# EAGLE schematic main_box_pcb_v0 (EAGLE 9.7.0)
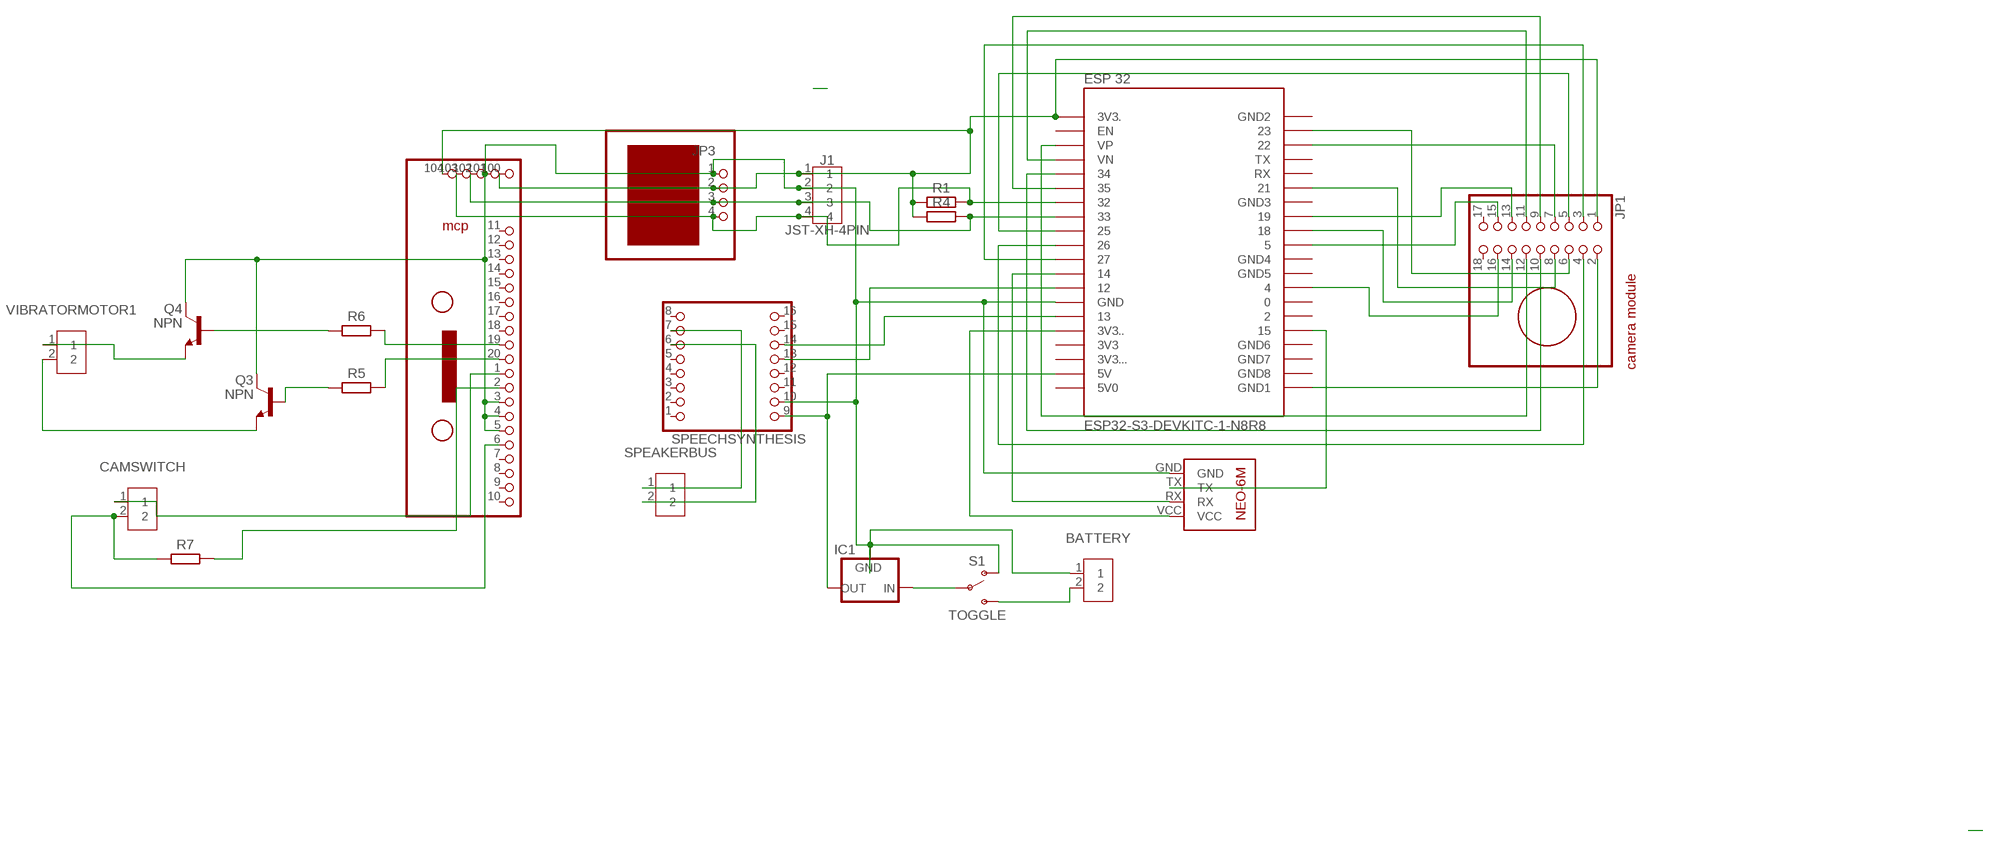
[diagram p0: schematic, sheet 1]

## Parts
BATTERY  JST-VH-2PIN  B2P-VH  [B2P-VH_396-2N]
CAMSWITCH  JST-VH-2PIN  B2P-VH  [B2P-VH_396-2N]
IC1  78MXXS  [78MXXS]
J1  JST-XH-4PIN  B4B-XH-A  [B4B-XH-A]
JP1  PINHD-2X9  [2X09]
JP3  PINHD-1X4  [1X04]
JP5  PINHD-1X10  [1X10]
Q3  NPN  NPN_TO92-EBC  [TO92]
Q4  NPN  NPN_TO92-EBC  [TO92]
R1  RESISTOR__AXIAL-11.7MM-PITCH  [RESAD1176W63L850D250B]
R4  RESISTOR__AXIAL-11.7MM-PITCH  [RESAD1176W63L850D250B]
R5  RESISTOR__AXIAL-7.2MM-PITCH  [RESAD724W46L381D178B]
R6  RESISTOR__AXIAL-7.2MM-PITCH  [RESAD724W46L381D178B]
R7  RESISTOR__AXIAL-7.2MM-PITCH  [RESAD724W46L381D178B]
S1  TOGGLE  [SWITCH-SPDT-PTH-8.5X3.7MM]
SPEAKERBUS  JST-VH-2PIN  B2P-VH  [B2P-VH_396-2N]
SPEECHSYNTHESIS  PINHD-1X8  [1X08]
U$1  ESP32-S3-DEVKITC-1-N8R8  [ESP32-S3-DEVKITC-1-N8R8]
U$2  NEO-6M  [NEO-6M]
VIBRATORMOTOR1  JST-VH-2PIN  B2P-VH  [B2P-VH_396-2N]

## Nets
N$1: IC1.OUT SPEECHSYNTHESIS.9(VCC) U$1.J1_20(5V)
N$3: JP1.2(GND) U$1.J3_21(GND1)
N$4: JP1.3(SIOC) U$1.J1_12
N$5: JP1.4(SIOD) U$1.J1_11
N$6: JP1.5(VSYNC) U$1.J1_10
N$7: JP1.6(HREF) U$1.J3_3
N$8: JP1.7(PCLK) U$1.J3_4
N$9: JP1.8(XCLK) U$1.J3_7
N$10: JP1.9(D9) U$1.J1_7
N$11: JP1.10(D8) U$1.J1_6
N$12: JP1.11(D7) U$1.J1_5(VN)
N$13: JP1.12(D6) U$1.J1_4(VP)
N$14: JP1.13(D5) U$1.J3_9
N$15: JP1.14(D4) U$1.J3_10
N$16: JP1.15(D2) U$1.J3_11
N$17: JP1.16(D1) U$1.J3_14
N$18: U$1.J1_17(3V3..) U$2.VCC
N$19: J1.4 JP3.4 JP5.103 R1.2 U$1.J1_8
N$20: J1.3 JP3.3 JP5.102 R4.2 U$1.J1_9
N$21: SPEAKERBUS.1 SPEECHSYNTHESIS.7(GND1)
N$22: JP5.20(PB0) R5.2
N$24: JP5.19(PB1) R6.2
N$25: IC1.IN S1.2(P)
N$26: U$1.J3_17 U$2.TX
N$27: U$1.J1_13 U$2.RX
N$28: BATTERY.2 S1.3(S)
N$29: SPEECHSYNTHESIS.13(DAC_L) U$1.J1_14
N$30: SPEECHSYNTHESIS.14(SPK_1) U$1.J1_16
N$31: BATTERY.1 IC1.GND J1.2 JP3.1 JP5.3(PA0) JP5.4(PA1) JP5.5(PA2) JP5.101 Q3.3(C) Q4.3(C) S1.1(O) SPEECHSYNTHESIS.10(RX) U$1.J1_15(GND) U$2.GND
N$32: SPEAKERBUS.2 SPEECHSYNTHESIS.6(IO_2)
N$36: J1.1 JP1.1(3.3) JP3.2 JP5.100 JP5.104 R1.1 R4.1 U$1.J1_2(3V3.)
N$42: Q4.2(B) R6.1
N$44: Q3.2(B) R5.1
N$45: Q3.1(E) VIBRATORMOTOR1.2
N$46: Q4.1(E) VIBRATORMOTOR1.1
N$47: CAMSWITCH.1 JP5.1(VCC)
N$48: JP5.2(GND) R7.2
N$50: CAMSWITCH.2 JP5.6(PA3) R7.1
Unconnected: JP1.17(RET) JP1.18(PWDN) JP5.7(PA4) JP5.8(PA5) JP5.9(PA6) JP5.10(PA7) JP5.11(VCC1) JP5.12 JP5.13(PB7) JP5.14(PB6) JP5.15(PB5) JP5.16(PB4) JP5.17(PB3) JP5.18(PB2) SPEECHSYNTHESIS.1(BUSY) SPEECHSYNTHESIS.2(USB-) SPEECHSYNTHESIS.3(USB+) SPEECHSYNTHESIS.4(ADKEY_2) SPEECHSYNTHESIS.5(ADKEY_1) SPEECHSYNTHESIS.8(IO_1) SPEECHSYNTHESIS.11(TX) SPEECHSYNTHESIS.12(DAC_R) SPEECHSYNTHESIS.15(GND) SPEECHSYNTHESIS.16(SPK_2) U$1.J1_3(EN) U$1.J1_18(3V3) U$1.J1_19(3V3...) U$1.J3_2(GND2) U$1.J3_5(TX) U$1.J3_6(RX) U$1.J3_8(GND3) U$1.J3_12(GND4) U$1.J3_13(GND5) U$1.J3_15 U$1.J3_16 U$1.J3_18(GND6) U$1.J3_19(GND7) U$1.J3_20(GND8)

## Power pins joined to a net without a drawn wire
5V0: U$1.J1_21(5V0)

## Library data of the parts
BATTERY CAMSWITCH SPEAKERBUS VIBRATORMOTOR1 = Connector:B2P-VH: VH Connector Top Entry - 2POS, 3.96MM Details see: Datasheet <http://www.jst-mfg.com/product/pdf/eng/eVH.pdf>; CATEGORY: Header; DESCRIPTION: Connector Header Through Hole 2 position 0.156" (3.96mm); MANUFACTURER: JST Sales America Inc.; MPN: B2P-VH; OPERATING_TEMPERATURE: -25°C ~ 85°C; PART_STATUS: Active; PITCH: 0.156" (3.96mm); ROHS_COMPLIANCE: RoHS non-compliant; SERIES: VH; SUBCATEGORY: Rectangular Connectors; TYPE: Header, Male Pin, Board to Cable/Wire, Through Hole
IC1 = v-reg:78MXXS: VOLTAGE REGULATOR
J1 = Connector:B4B-XH-A: XH Connector Top Entry - 4POS Details see: Datasheet <http://www.jst-mfg.com/product/pdf/eng/eXH.pdf>; CATEGORY: Header; DSECRIPTION: Connector Header Through Hole 4 position 0.098" (2.50mm); MANUFACTURER: JST Sales America Inc.; MPN: B4B-XH-A(LF)(SN); OPERATING_TEMPERATURE: -25 C to 85 C; PART_STATUS: ACTIVE; PITCH: 0.098" (2.50mm); ROHS_COMPLIANCE: ROHS3 Compliant; SERIES: XH; SUB_CATEGORY: Rectangular Connectors; TYPE: Header, Male Pin, Board to Cable/Wire, Through Hole
JP1 = camera module:PINHD-2X9: PIN HEADER
JP3 = camera module:PINHD-1X4: PIN HEADER
JP5 = camera module:PINHD-1X10: PIN HEADER
Q3 Q4 = Transistor:NPN: NPN - Generic; CATEGORY: Transistor; SUB-CATEGORY: BJT; TYPE: NPN
R1 R4-R7 = Tinkercad:RESISTOR: Resistor Fixed - Generic; CATEGORY: Resistor; SUB-CATEGORY: Fixed
S1 = Tinkercad:TOGGLE
SPEECHSYNTHESIS = speech synthesis:PINHD-1X8: PIN HEADER
U$1 = ESP32-S3-DEVKITC-1-N8R8:ESP32-S3-DEVKITC-1-N8R8; CHECK_PRICES: https://www.snapeda.com/parts/ESP32-S3-DEVKITC-1-N8R8/Espressif+Systems/view-part/?ref=eda; DESCRIPTION: The ESP32-S3-DEVKITC-1-N8R8 from Espressif Systems is a development board designed for RF, RFID, and wireless applications. It supports 802.11 b/g/n Wi-Fi and Bluetooth® 5.x (BLE) connectivity at 2.4GHz, making it ideal for IoT and wireless communication projects. This board is powered by the ESP32-S3-WROOM-1-N8R8 module, which features 8MB Quad SPI Flash and 8MB Octal SPI for efficient memory storage and processing.; DIGIKEY_PART_NUMBER: 1965-ESP32-S3-DEVKITC-1-N8R8-ND; MF: Espressif Systems; MP: ESP32-S3-DEVKITC-1-N8R8; PACKAGE: None; SNAPEDA_LINK: https://www.snapeda.com/parts/ESP32-S3-DEVKITC-1-N8R8/Espressif+Systems/view-part/?ref=snap
U$2 = NEO-6M:NEO-6M: Check availability <https://pricing.snapeda.com/parts/NEO-6M/U-blox/view-part?ref=eda>; AVAILABILITY: In Stock; CHECK_PRICES: https://www.snapeda.com/parts/NEO-6M/u-blox/view-part/?ref=eda; MF: U-blox; MP: NEO-6M; PACKAGE: None; PRICE: None; SNAPEDA_LINK: https://www.snapeda.com/parts/NEO-6M/u-blox/view-part/?ref=snap